# EasyEDA Pro project ASTROPET_SENSOR_SOURCE.epro, schematic Schematic1
Board Name: indoors; Create Date: 2026-06-05; Page Name: P1; Project Name: light pollution thingy; Schematic Name: Schematic1; Update Date: 2026-06-06; Company: EasyEDA.com; Page Size: A4; Version: V1.0
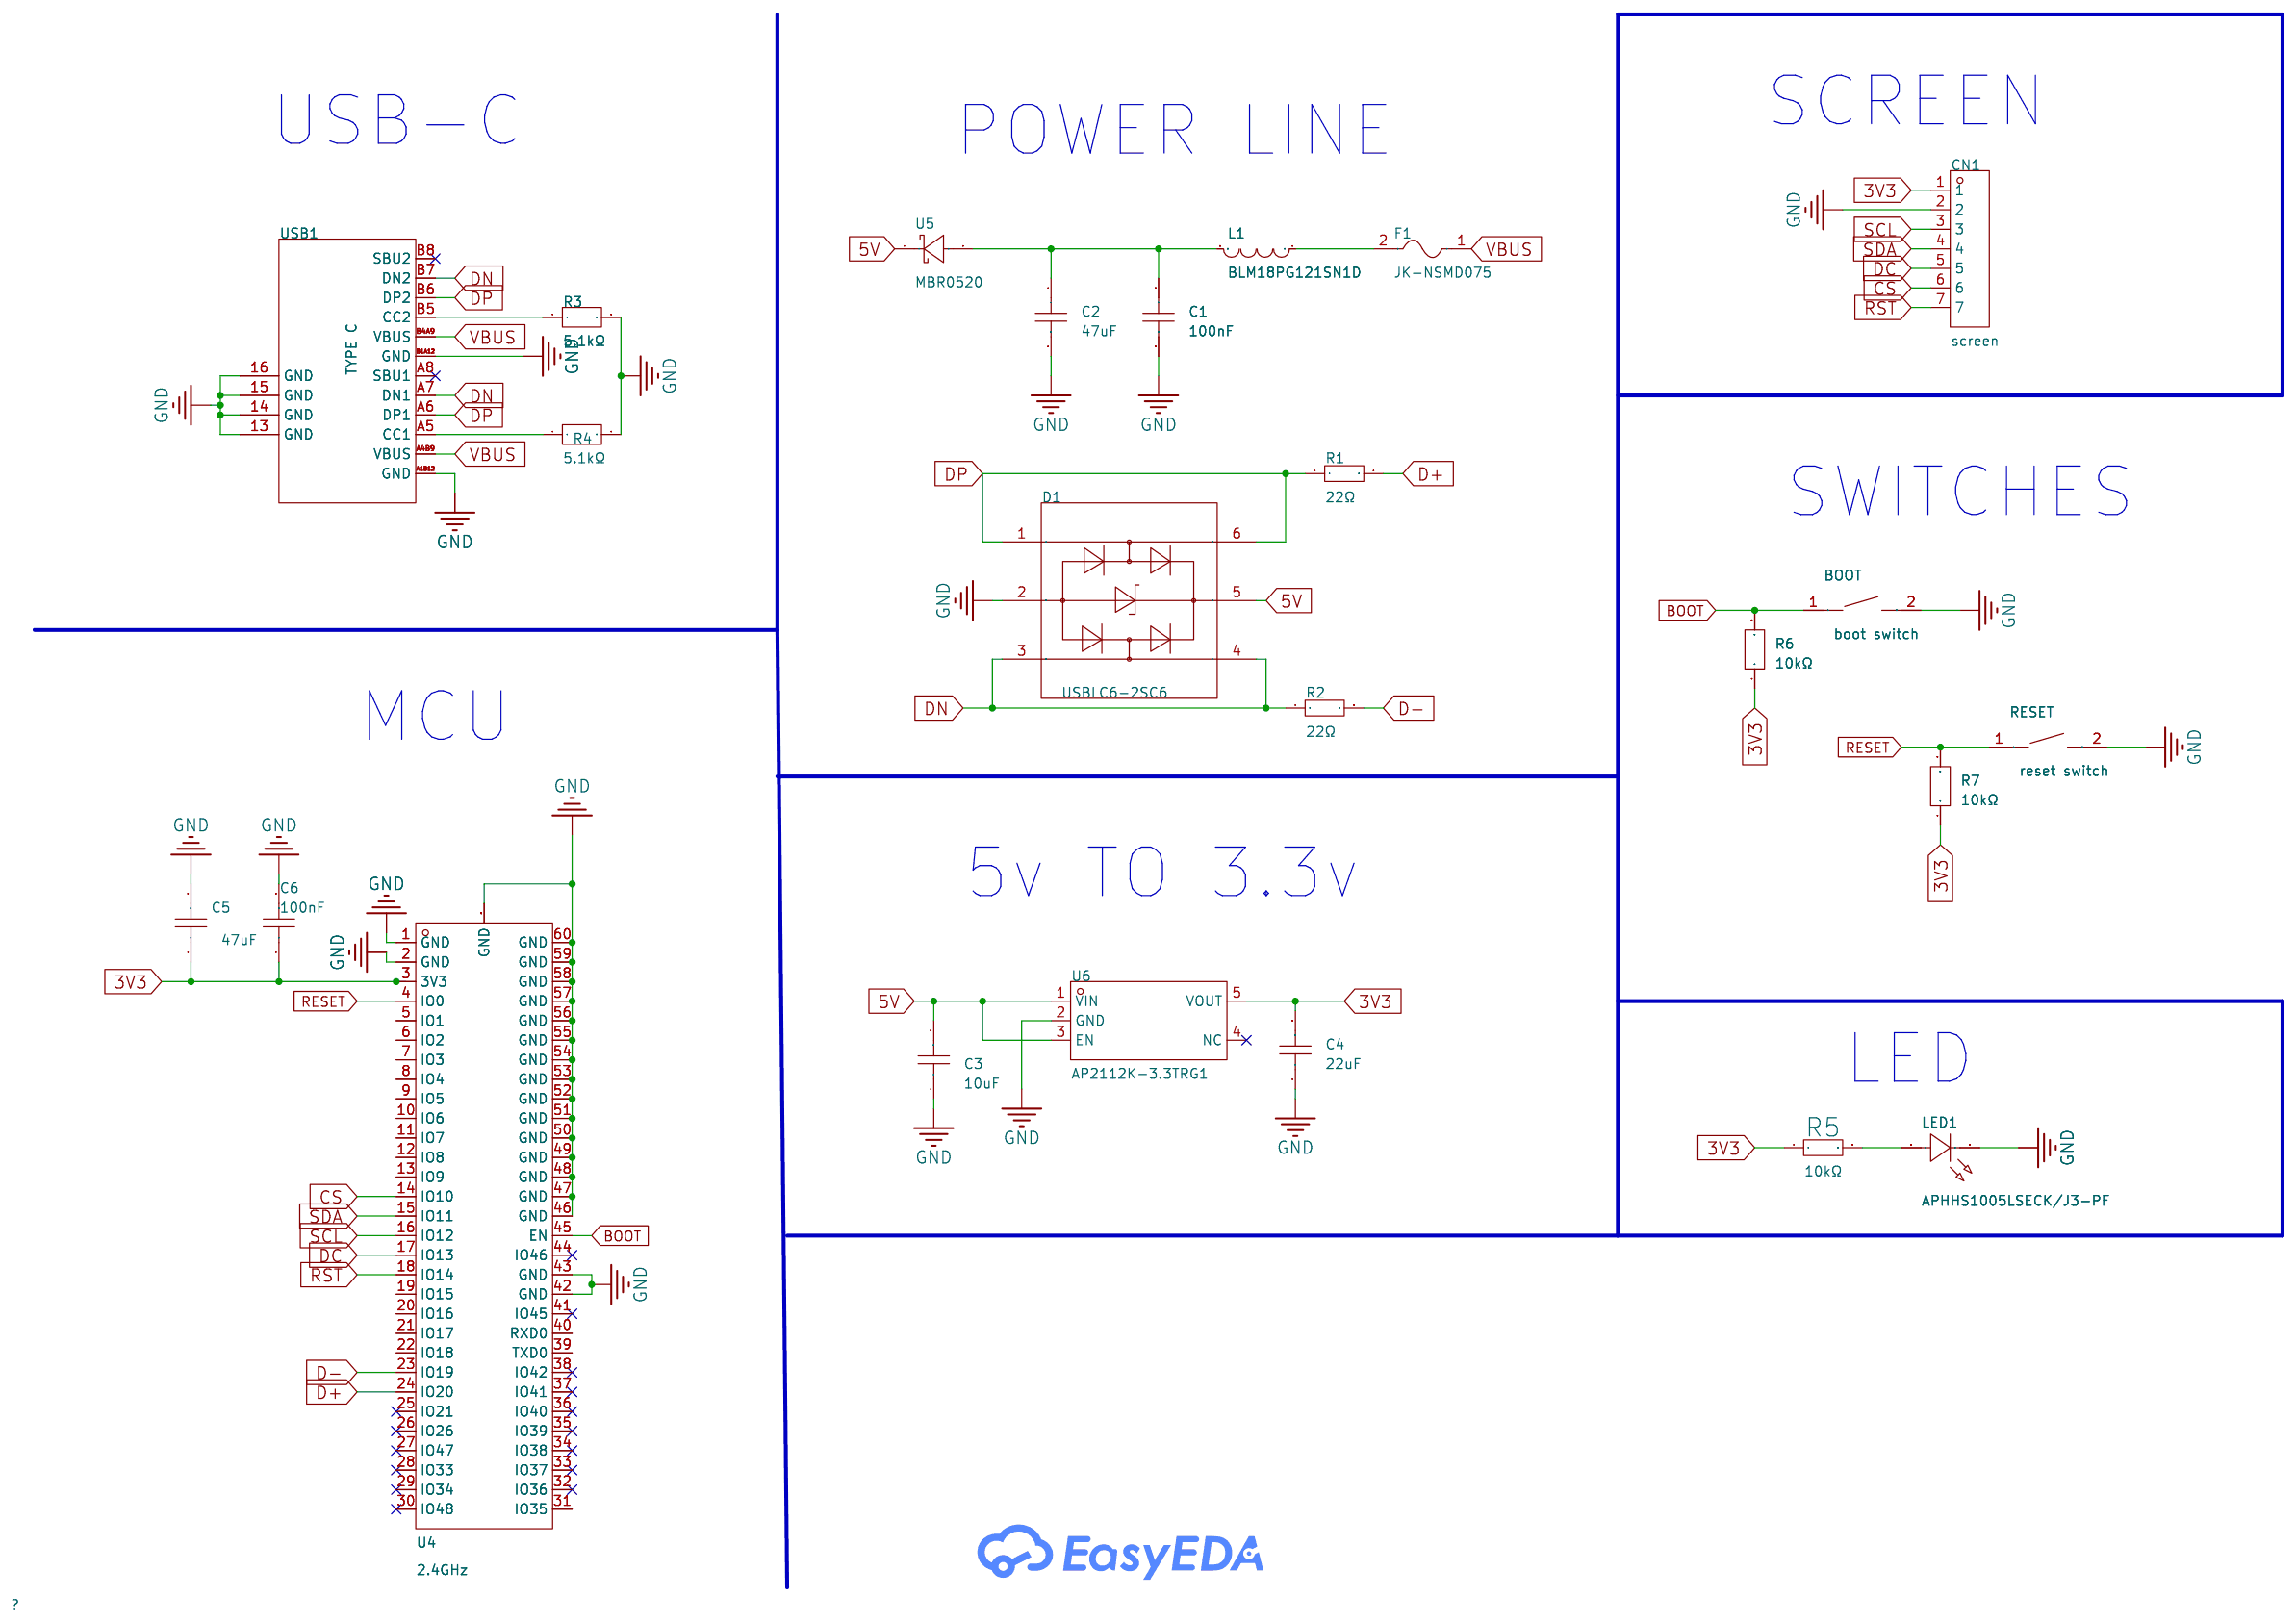
[diagram p0: schematic sheet]

## Parts
BOOT  boot switch  [SW-SMD_L3.9-W3.0-P4.45]
C1  100nF  [C0603]
C2  47uF  [C0805]
C3  10uF  [C0805]
C4  22uF  [C0805]
C5  47uF  [C0805]
C6  100nF  [C0603]
CN1  screen  [HDR-TH_7P-P2.54-V-F]
D1  USBLC6-2SC6  [SOT-23-6_L2.9-W1.6-P0.95-LS2.8-BL]
F1  JK-NSMD075  [F1206]
L1  BLM18PG121SN1D  [L0603]
LED1  APHHS1005LSECK/J3-PF  [LED0402-RD_RED]
R1  22Ω  [R0603]
R2  22Ω  [R0603]
R3  5.1kΩ  [R0603]
R4  5.1kΩ  [R0603]
R5  10kΩ  [R0603]
R6  10kΩ  [R0603]
R7  10kΩ  [R0603]
RESET  reset switch  [SW-SMD_L3.9-W3.0-P4.45]
U4  2.4GHz  [BULETM-SMD_ESP32-S3-MINI-1-N8]
U5  MBR0520  [SOD-123_L2.7-W1.6-LS3.7-RD-A]
U6  AP2112K-3.3TRG1  [SOT-25-5_L2.9-W1.6-P0.95-LS2.8-BL]
USB1  TYPE C  [USB-C-SMD_TYPEC-304J-BCP16]

## Library data of the parts
BOOT RESET = TS-1088-AR02016: Circuit:SPST Actuator Style:Round Button Operating Force:1.6N Mounting Type:Surface Mount,Vertical Length:4mm Width:3mm Switch Height:2mm with Bracket:Without Bracket Contact Current:50mA Voltage Rating:12V Actuator/Cap Color:Black Termination Style:SMD(S; LCSC Part Name: 4*3*2mm 立贴 轻触开关; Supplier Part: C720477; Manufacturer: XUNPU(讯普); Supplier Footprint: SMD,4x3mm; JLCPCB Part Class: Basic Part; Datasheet: https://item.szlcsc.com/datasheet/TS-1088-AR02016/763484.html; Supplier: LCSC; Circuit: SPST; Actuator Style: Round Button; Operating Force: 1.6N; Mounting Type: Surface Mount,Vertical; Length: 4mm; Width: 3mm; Switch Height: 2mm; with Bracket: Without Bracket; Contact Current: 50mA; Voltage Rating: 12V; Actuator/Cap Color: Black; Termination Style: SMD(SMT) Tab; Life: 100,000 Cycles; Operating Temperature: -30℃~+80℃
C1 C6 = CC0603KRX7R9BB104: Capacitance:100nF Tolerance:±10% Tolerance:±10% Voltage Rating:50V Temperature Coefficient:X7R; LCSC Part Name: 100nF ±10% 50V; Supplier Part: C14663; Manufacturer: YAGEO(国巨); Supplier Footprint: 0603; Datasheet: https://item.szlcsc.com/datasheet/CC0603KRX7R9BB104/15331.html; Supplier: LCSC; Tolerance: ±10%; Voltage Rating: 50V; Temperature Coefficient: X7R
C2 C5 = CGA0805X5R476M100MT: Capacitance:47uF Tolerance:±20% Tolerance:±20% Voltage Rating:10V Temperature Coefficient:X5R; LCSC Part Name: 47uF ±20% 10V; Supplier Part: C6119904; Manufacturer: HRE(芯声); Supplier Footprint: 0805; JLCPCB Part Class: Extended Part; Datasheet: https://item.szlcsc.com/datasheet/CGA0805X5R476M100MT/7062610.html; Supplier: LCSC; Tolerance: ±20%; Voltage Rating: 10V; Temperature Coefficient: X5R
C3 = CL21A106KAYNNNE_C15850: Capacitance:10uF Tolerance:±10% Tolerance:±10% Voltage Rating:25V Temperature Coefficient:X5R; LCSC Part Name: 10uF ±10% 25V; Supplier Part: C15850; Manufacturer: SAMSUNG(三星); Manufacturer Part: CL21A106KAYNNNE; Supplier Footprint: 0805; JLCPCB Part Class: Basic Part; Datasheet: https://item.szlcsc.com/datasheet/CL21A106KAYNNNE/16532.html; Supplier: LCSC; Tolerance: ±10%; Voltage Rating: 25V; Temperature Coefficient: X5R
C4 = CL21A226MQQNNNE: Capacitance:22uF Tolerance:±20% Tolerance:±20% Voltage Rating:6.3V Temperature Coefficient:X5R; LCSC Part Name: 22uF ±20% 6.3V; Supplier Part: C5674; Manufacturer: SAMSUNG(三星); Supplier Footprint: 0805; Datasheet: https://item.szlcsc.com/datasheet/CL21A226MQQNNNE/6133.html; Supplier: LCSC; Tolerance: ±20%; Voltage Rating: 6.3V; Temperature Coefficient: X5R
CN1 = HX PM2.54-1x7P ZC-Y: Holes Structure:1x7P Pitch:2.54mm Row Spacing:- Circular Hole / Square Hole:Square Hole Mounting Type:Through Hole Number of Rows:1 Number of Positions:7P Current Rating:3A Voltage Rating (Max):1kV Holes Direction:Top Insulation Height:8.5mm Contact Mater; LCSC Part Name: 1x7P 间距:2.54mm 直插; Supplier Part: C22438157; Manufacturer: hanxia(韩下); Supplier Footprint: 插件,P=2.54mm; Datasheet: https://item.szlcsc.com/datasheet/HX%2520PM2.54-1x7P%2520ZC-Y/24075304.html; Supplier: LCSC; Holes Structure: 1x7P; Pitch: 2.54mm; Circular Hole / Square Hole: Square Hole; Mounting Type: Through Hole; Number of Rows: 1; Number of Positions: 7P; Current Rating: 3A; Voltage Rating (Max): 1kV; Holes Direction: Top; Insulation Height: 8.5mm; Contact Material: Phosphor Bronze; Contact Plating: Gold; Operating Temperature: -40℃~+105℃; PIN Length: 3.2mm
D1 = USBLC6-2SC6_C7519: Polarity:Unidirectional Reverse Stand-Off Voltage (Vrwm):5.25V Clamping Voltage:17V Peak Pulse Current (Ipp):5A Voltage - Breakdown:6V Reverse Leakage Current (Ir):150nA Number of Channels:2 Operating Temperature:-40℃~+125℃ Operating Temperature:-40℃~+125; LCSC Part Name: 单向ESD; Supplier Part: C7519; Manufacturer: ST(意法半导体); Supplier Footprint: SOT-23-6L; Datasheet: https://item.szlcsc.com/datasheet/USBLC6-2SC6/7996.html; Supplier: LCSC; Polarity: Unidirectional; Reverse Stand-Off Voltage (Vrwm): 5.25V; Clamping Voltage: 17V; Peak Pulse Current (Ipp): 5A; Voltage - Breakdown: 6V; Reverse Leakage Current (Ir): 150nA; Number of Channels: 2; Operating Temperature: -40℃~+125℃; level of protection: IEC 61000-4-2; Type: ESD; Junction Capacitance: 3.5pF
F1 = JK-NSMD075: Voltage - Max:6V Current - Max:100A Hold Current:750mA Trip Current:1.5A Power Dissipation:- Resistance - Initial (Ri) (Min):90mΩ Resistance - Post Trip (R1) (Max):500mΩ Time to Trip(Max):200ms Operating Temperature:-40℃~+85℃ Operating Temperature:-40℃~+8; LCSC Part Name: 6V 750mA 1206自恢复; Supplier Part: C2830242; Manufacturer: JK(金科); Supplier Footprint: 1206; Datasheet: https://item.szlcsc.com/datasheet/JK-NSMD075/726297.html; Supplier: LCSC; Voltage - Max: 6V; Current - Max: 100A; Hold Current: 750mA; Trip Current: 1.5A; Resistance - Initial (Ri) (Min): 90mΩ; Resistance - Post Trip (R1) (Max): 500mΩ; Time to Trip(Max): 200ms; Operating Temperature: -40℃~+85℃; Length: 3.5mm; Width: 1.8mm; Height: 0.85mm
L1 = BLM18PG121SN1D_C14709: Impedance @ Frequency:120Ω@100MHz Tolerance:±25% Tolerance:±25% DC Resistance(DCR):50mΩ Current Rating:2A Number of Circuits:1 Operating Temperature:-55℃~+125℃ Operating Temperature:-55℃~+125℃; LCSC Part Name: 单路 0603磁珠 阻抗120Ω@100MHz; Supplier Part: C14709; Manufacturer: muRata(村田); Supplier Footprint: 0603; JLCPCB Part Class: Basic Part; Datasheet: https://item.szlcsc.com/datasheet/BLM18PG121SN1D/15379.html; Supplier: LCSC; Impedance @ Frequency: 120Ω@100MHz; Tolerance: ±25%; DC Resistance(DCR): 50mΩ; Current Rating: 2A; Number of Circuits: 1; Operating Temperature: -55℃~+125℃
LED1 = APHHS1005LSECK/J3-PF: Lamp Holder Type:- Illumination Color:Red Voltage - Forward(Vf):1.8V Voltage - Forward(Vf):1.8V Power(Watts):84mW Forward Current:2mA Wavelength - Dominant:625nm Wavelength - Dominant:625nm Peak Wavelength:640nm Diode Configuration:Discrete Diode Lens Col; LCSC Part Name: 1.0x0.5 mm贴片式芯片LED灯; Supplier Part: C5354976; Manufacturer: Kingbright(今台); Supplier Footprint: 0402; JLCPCB Part Class: Extended Part; Datasheet: https://item.szlcsc.com/datasheet/APHHS1005LSECK%252FJ3-PF/6154435.html; Supplier: LCSC; Illumination Color: Red; Voltage - Forward(Vf): 1.8V; Power(Watts): 84mW; Forward Current: 2mA; Wavelength - Dominant: 625nm; Peak Wavelength: 640nm; Diode Configuration: Discrete Diode; Lens Color: Water Clear; Luminous Intensity: 80mcd; Viewing Angle: 120°; Operating Temperature: -40℃~+85℃
R1 R2 = 0603WAF220JT5E: Type:Thick Film Resistors Resistance:22Ω Tolerance:±1% Tolerance:±1% Power(Watts): Overload Voltage (Max): Temperature Coefficient:±100ppm/℃ Temperature Coefficient:±100ppm/℃ Operating Temperature Range:-55℃~+155℃ Operating Temperature Range:-55℃~+155℃; LCSC Part Name: 22Ω ±1% 100mW 厚膜电阻; Supplier Part: C23345; Manufacturer: UNI-ROYAL(厚声); Supplier Footprint: 0603; JLCPCB Part Class: Basic Part; Datasheet: https://atta.szlcsc.com/upload/public/pdf/source/20200306/C422600_1E6D84923E4A46A82E41ADD87F860B5C.pdf; Supplier: LCSC; Type: Thick Film Resistors; Tolerance: ±1%; Temperature Coefficient: ±100ppm/℃; Operating Temperature Range: -55℃~+155℃
R3 R4 = FRC0603F5101TS: Type:Thick Film Resistor Resistance:5.1kΩ Tolerance:±1% Tolerance:±1% Power(Watts):100mW Voltage-Supply(Max):75V Temperature Coefficient:±100ppm/℃ Temperature Coefficient:±100ppm/℃ Operating Temperature:-55℃~+155℃ Operating Temperature:-55℃~+155℃; LCSC Part Name: 5.1kΩ ±1% 100mW 厚膜电阻; Supplier Part: C2907044; Manufacturer: FOJAN(富捷); Supplier Footprint: 0603; JLCPCB Part Class: Extended Part; Supplier: LCSC; Type: Thick Film Resistor; Tolerance: ±1%; Power(Watts): 100mW; Voltage-Supply(Max): 75V; Temperature Coefficient: ±100ppm/℃; Operating Temperature: -55℃~+155℃
R5 = 0603WAF1002T5E: Type:Thick Film Resistor Resistance:10kΩ Tolerance:±1% Tolerance:±1% Power(Watts):100mW Voltage-Supply(Max):75V Temperature Coefficient:±100ppm/℃ Temperature Coefficient:±100ppm/℃ Operating Temperature:-55℃~+155℃ Operating Temperature:-55℃~+155℃; LCSC Part Name: 厚膜电阻 10kΩ ±1% 100mW; Supplier Part: C25804; Manufacturer: UNI-ROYAL(厚声); Supplier Footprint: 0603; Datasheet: https://item.szlcsc.com/datasheet/0603WAF1002T5E/26547.html; Supplier: LCSC; Type: Thick Film Resistor; Tolerance: ±1%; Power(Watts): 100mW; Voltage-Supply(Max): 75V; Temperature Coefficient: ±100ppm/℃; Operating Temperature: -55℃~+155℃
R6 R7 = FRC0603J103 TS: Type:Thick Film Resistor Resistance:10kΩ Tolerance:±5% Tolerance:±5% Power(Watts):100mW Voltage-Supply(Max):75V Temperature Coefficient:±100ppm/℃ Temperature Coefficient:±100ppm/℃ Operating Temperature:-55℃~+155℃ Operating Temperature:-55℃~+155℃; LCSC Part Name: 10kΩ ±5% 100mW 厚膜电阻; Supplier Part: C2930027; Manufacturer: FOJAN(富捷); Supplier Footprint: 0603; JLCPCB Part Class: Extended Part; Datasheet: https://item.szlcsc.com/datasheet/FRC0603J103%2520TS/3266960.html; Supplier: LCSC; Type: Thick Film Resistor; Tolerance: ±5%; Power(Watts): 100mW; Voltage-Supply(Max): 75V; Temperature Coefficient: ±100ppm/℃; Operating Temperature: -55℃~+155℃
U4 = ESP32-S3-MINI-1-N4R2: Utilized IC / Part:ESP32-S3 Wireless Standard:Bluetooth5.0 Interface Type:I2C；GPIO；UART；SPI；USB；I2S Frequency:2.4GHz Antenna Type:On-board PCB Antenna Output Power:20.5dBm Output Power:20.5dBm Voltage - Supply:3V~3.6V Voltage - Supply:3V~3.6V Receive  Cur; LCSC Part Name: 不带固件 小尺寸模组，集成2.4GHz Wi-Fi(802.11b/g/n)+Bluetooth 5(LE); Supplier Part: C3013941; Manufacturer: ESPRESSIF(乐鑫); Supplier Footprint: SMD; Datasheet: https://item.szlcsc.com/datasheet/ESP32-S3-MINI-1-N4R2/3522411.html; Supplier: LCSC; Utilized IC / Part: ESP32-S3; Wireless Standard: Bluetooth5.0; Interface Type: I2C；GPIO；UART；SPI；USB；I2S; Antenna Type: On-board PCB Antenna; Output Power: 20.5dBm; Voltage - Supply: 3V~3.6V; Receive  Current: 95mA; Send  Current: 355mA; Sensitivity: -103.5dBm; Operating Temperature: -40℃~+85℃
U5 = MBR0520_C5204745: Diode Configuration:Independent Voltage - Forward(Vf@If):440mV@0.5A Voltage - DC Reverse(Vr):20V Current - Rectified:500mA Reverse Leakage Current (Ir):150uA Non-Repetitive Peak Forward Surge Current:5.5A; LCSC Part Name: 电压:20V 电流:500mA; Supplier Part: C5204745; Manufacturer: TWGMC(迪嘉); Supplier Footprint: SOD-123; JLCPCB Part Class: Extended Part; Datasheet: https://item.szlcsc.com/datasheet/MBR0520/5894894.html; Supplier: LCSC; Diode Configuration: Independent; Voltage - Forward(Vf@If): 440mV@0.5A; Voltage - DC Reverse(Vr): 20V; Current - Rectified: 500mA; Reverse Leakage Current (Ir): 150uA; Non-Repetitive Peak Forward Surge Current: 5.5A
U6 = AP2112K-3.3TRG1: Output Type:Fixed Voltage - Supply:6V Output Voltage:3.3V Output Voltage:3.3V Output Current:600mA Power Supply Rejection Ratio (PSRR):65dB@(1kHz) Voltage Dropout:250mV@(600mA) standby current:55uA Noise:50uVrms Features:Enable；Over Temperature Protection; LCSC Part Name: 输入6V 输出3.3V 600mA; Supplier Part: C51118; Manufacturer: DIODES(美台); Supplier Footprint: SOT-25-5; JLCPCB Part Class: Extended Part; Datasheet: https://item.szlcsc.com/datasheet/AP2112K-3.3TRG1/52131.html; Supplier: LCSC; Output Type: Fixed; Voltage - Supply: 6V; Output Voltage: 3.3V; Output Current: 600mA; Power Supply Rejection Ratio (PSRR): 65dB@(1kHz); Voltage Dropout: 250mV@(600mA); standby current: 55uA; Noise: 50uVrms; Features: Enable；Over Temperature Protection；Over Current Protection; Operating Temperature: -40℃~+85℃@(Ta); Output Configuration: Positive; Number of Outputs: 1
USB1 = TYPEC-304J-BCP16: Connector Type:Type-C Protocol Standard:- Gender:Female Mounting Type:Surface Mount, Right Angle Number of Contacts:16P Number of Ports:1 Current Rating-Power:5A Voltage Rating:20V Connect-Disconnect Life:10,000 cycles Supplementary Features:- Center Heig; LCSC Part Name: Type-C 母 卧贴; Supplier Part: C2835315; Manufacturer: XUNPU(讯普); Supplier Footprint: SMD; JLCPCB Part Class: Extended Part; Datasheet: https://item.szlcsc.com/datasheet/TYPEC-304J-BCP16/2998973.html; Supplier: LCSC; Connector Type: Type-C; Gender: Female; Mounting Type: Surface Mount, Right Angle; Number of Contacts: 16P; Number of Ports: 1; Current Rating-Power: 5A; Voltage Rating: 20V; Connect-Disconnect Life: 10,000 cycles; Length: 7.35mm; Detection color: Black; Operating Temperature: -40℃~+85℃

## Nets
3V3: C4.2 C5.1 C6.1 CN1.1 R5.1 R6.1 R7.1 U4.3(3V3) U6.5(VOUT)
5V: C3.2 D1.5 U5.1(K) U6.1(VIN) U6.3(EN)
GND: BOOT.2 C1.2 C2.2 C3.1 C4.1 C5.2 C6.2 CN1.2 D1.2 LED1.1(K) R3.2 R4.2 RESET.2 U4.1(GND) U4.2(GND) U4.42(GND) U4.43(GND) U4.46(GND) U4.47(GND) U4.48(GND) U4.49(GND) U4.50(GND) U4.51(GND) U4.52(GND) U4.53(GND) U4.54(GND) U4.55(GND) U4.56(GND) U4.57(GND) U4.58(GND) U4.59(GND) U4.60(GND) U4.GND U6.2(GND) USB1.13(GND) USB1.14(GND) USB1.15(GND) USB1.16(GND) USB1.A1B12(GND) USB1.B1A12(GND)
VBUS: F1.1 USB1.A4B9(VBUS) USB1.B4A9(VBUS)
BOOT: BOOT.1 R6.2 U4.45(EN)
CS: CN1.6 U4.14(IO10)
D+: R1.2 U4.24(IO20)
D-: R2.2 U4.23(IO19)
DC: CN1.5 U4.17(IO13)
DN: D1.3 D1.4 R2.1 USB1.A7(DN1) USB1.B7(DN2)
DP: D1.1 D1.6 R1.1 USB1.A6(DP1) USB1.B6(DP2)
RESET: R7.2 RESET.1 U4.4(IO0)
RST: CN1.7 U4.18(IO14)
SCL: CN1.3 U4.16(IO12)
SDA: CN1.4 U4.15(IO11)
$1N603: R3.1 USB1.B5(CC2)
$1N746: R4.1 USB1.A5(CC1)
$1N1092: F1.2 L1.1
$1N1098: C1.1 C2.1 L1.2 U5.2(A)
$1N1982: LED1.2(A) R5.2

Not connected (* = marked no-connect by the designer): U4 5(IO1) 6(IO2) 7(IO3) 8(IO4) 9(IO5) 10(IO6) 11(IO7) 12(IO8) 13(IO9) 19(IO15) 20(IO16) 21(IO17) 22(IO18) 25(IO21)* 26(IO26)* 27(IO47)* 28(IO33)* 29(IO34)* 30(IO48)* 31(IO35) 32(IO36)* 33(IO37)* 34(IO38)* 35(IO39)* 36(IO40)* 37(IO41)* 38(IO42)* 39(TXD0) 40(RXD0) 41(IO45)* 44(IO46)*; U6 4(NC)*; USB1 A8(SBU1)* B8(SBU2)*

## Notes on the sheet
- SCREEN
- USB-C
- POWER LINE
- SWITCHES
- MCU
- 5v TO 3.3v
- LED
